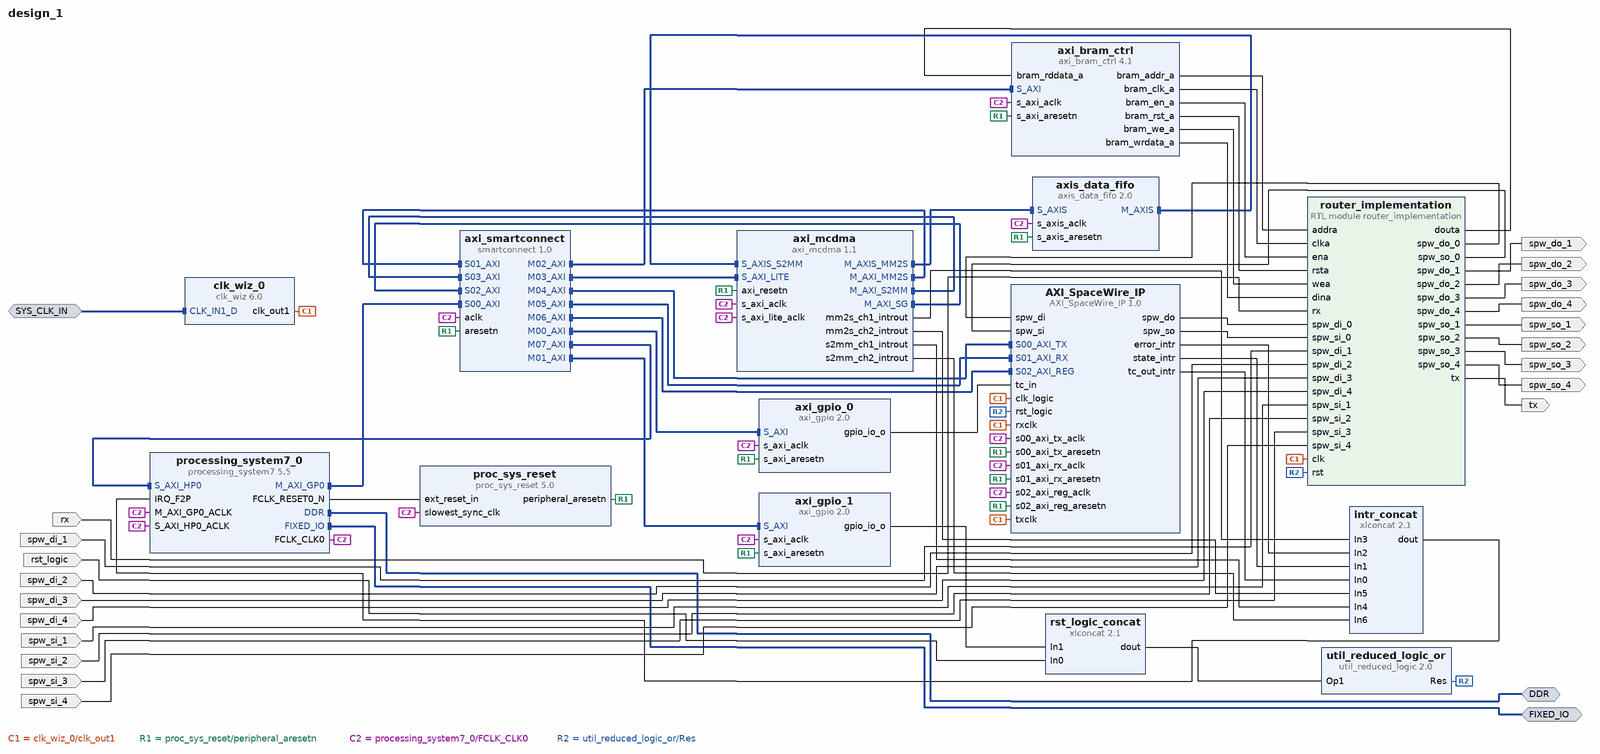
[diagram p0: block diagram of the top level]
# Vivado block design design_1, xc7z045ffg900-2, Vivado 2022.1
create_bd_design design_1

create_bd_intf_port -mode Master -vlnv xilinx.com:interface:ddrx_rtl:1.0 DDR
create_bd_intf_port -mode Master -vlnv xilinx.com:display_processing_system7:fixedio_rtl:1.0 FIXED_IO
create_bd_intf_port -mode Slave -vlnv xilinx.com:interface:diff_clock_rtl:1.0 SYS_CLK_IN
create_bd_port -dir O tx
create_bd_port -dir I rx
create_bd_port -dir I -type rst rst_logic
set_property -dict {CONFIG.POLARITY ACTIVE_HIGH} [get_bd_ports rst_logic]
create_bd_port -dir I spw_di_1
create_bd_port -dir I spw_si_1
create_bd_port -dir I spw_di_2
create_bd_port -dir I spw_si_2
create_bd_port -dir I spw_di_3
create_bd_port -dir I spw_si_3
create_bd_port -dir I spw_di_4
create_bd_port -dir I spw_si_4
create_bd_port -dir O spw_do_1
create_bd_port -dir O spw_so_1
create_bd_port -dir O spw_do_2
create_bd_port -dir O spw_so_2
create_bd_port -dir O spw_do_3
create_bd_port -dir O spw_so_3
create_bd_port -dir O spw_do_4
create_bd_port -dir O spw_so_4

create_bd_cell -type ip -vlnv xilinx.com:ip:processing_system7:5.5 processing_system7_0
set_property -dict [list \
  CONFIG.PCW_APU_PERIPHERAL_FREQMHZ 667.000000 \
  CONFIG.PCW_DUAL_PARALLEL_QSPI_DATA_MODE x8 \
  CONFIG.PCW_ENET0_ENET0_IO {MIO 16 .. 27} \
  CONFIG.PCW_ENET0_GRP_MDIO_ENABLE 1 \
  CONFIG.PCW_ENET0_GRP_MDIO_IO {MIO 52 .. 53} \
  CONFIG.PCW_ENET0_PERIPHERAL_ENABLE 1 \
  CONFIG.PCW_ENET0_PERIPHERAL_FREQMHZ {100 Mbps} \
  CONFIG.PCW_ENET0_RESET_ENABLE 1 \
  CONFIG.PCW_ENET0_RESET_IO {MIO 47} \
  CONFIG.PCW_ENET_RESET_ENABLE 1 \
  CONFIG.PCW_ENET_RESET_SELECT {Share reset pin} \
  CONFIG.PCW_GPIO_MIO_GPIO_ENABLE 1 \
  CONFIG.PCW_GPIO_MIO_GPIO_IO MIO \
  CONFIG.PCW_I2C0_GRP_INT_ENABLE 0 \
  CONFIG.PCW_I2C0_I2C0_IO {MIO 50 .. 51} \
  CONFIG.PCW_I2C0_PERIPHERAL_ENABLE 1 \
  CONFIG.PCW_I2C0_RESET_ENABLE 1 \
  CONFIG.PCW_I2C0_RESET_IO {MIO 46} \
  CONFIG.PCW_I2C_PERIPHERAL_FREQMHZ 111.111115 \
  CONFIG.PCW_I2C_RESET_ENABLE 1 \
  CONFIG.PCW_I2C_RESET_SELECT {Share reset pin} \
  CONFIG.PCW_IRQ_F2P_INTR 1 \
  CONFIG.PCW_PRESET_BANK0_VOLTAGE {LVCMOS 1.8V} \
  CONFIG.PCW_PRESET_BANK1_VOLTAGE {LVCMOS 1.8V} \
  CONFIG.PCW_QSPI_GRP_FBCLK_ENABLE 1 \
  CONFIG.PCW_QSPI_GRP_FBCLK_IO {MIO 8} \
  CONFIG.PCW_QSPI_GRP_IO1_ENABLE 1 \
  CONFIG.PCW_QSPI_GRP_IO1_IO {MIO 0 9 .. 13} \
  CONFIG.PCW_QSPI_GRP_SINGLE_SS_ENABLE 0 \
  CONFIG.PCW_QSPI_INTERNAL_HIGHADDRESS 0xFDFFFFFF \
  CONFIG.PCW_QSPI_PERIPHERAL_ENABLE 1 \
  CONFIG.PCW_QSPI_QSPI_IO {MIO 1 .. 6} \
  CONFIG.PCW_SD0_GRP_CD_ENABLE 1 \
  CONFIG.PCW_SD0_GRP_CD_IO {MIO 14} \
  CONFIG.PCW_SD0_GRP_WP_ENABLE 1 \
  CONFIG.PCW_SD0_GRP_WP_IO {MIO 15} \
  CONFIG.PCW_SD0_PERIPHERAL_ENABLE 1 \
  CONFIG.PCW_SD0_SD0_IO {MIO 40 .. 45} \
  CONFIG.PCW_SDIO_PERIPHERAL_FREQMHZ 50 \
  CONFIG.PCW_TTC0_PERIPHERAL_ENABLE 1 \
  CONFIG.PCW_TTC0_TTC0_IO EMIO \
  CONFIG.PCW_UART1_PERIPHERAL_ENABLE 1 \
  CONFIG.PCW_UART1_UART1_IO {MIO 48 .. 49} \
  CONFIG.PCW_UART_PERIPHERAL_FREQMHZ 50 \
  CONFIG.PCW_UIPARAM_DDR_FREQ_MHZ 533.333313 \
  CONFIG.PCW_UIPARAM_DDR_PARTNO Custom \
  CONFIG.PCW_USB0_PERIPHERAL_ENABLE 1 \
  CONFIG.PCW_USB0_RESET_ENABLE 1 \
  CONFIG.PCW_USB0_RESET_IO {MIO 7} \
  CONFIG.PCW_USB0_USB0_IO {MIO 28 .. 39} \
  CONFIG.PCW_USB_RESET_ENABLE 1 \
  CONFIG.PCW_USB_RESET_SELECT {Share reset pin} \
  CONFIG.PCW_USE_FABRIC_INTERRUPT 1 \
  CONFIG.PCW_USE_S_AXI_HP0 1 \
  CONFIG.preset ZC706 \
] [get_bd_cells processing_system7_0]
# 235 more settings of processing_system7_0 are not shown: defaults, MIO pin electricals, DDR timing, and values the tool derives
create_bd_cell -type ip -vlnv xilinx.com:ip:xlconcat:2.1 intr_concat
set_property -dict {CONFIG.NUM_PORTS 7} [get_bd_cells intr_concat]
create_bd_cell -type ip -vlnv xilinx.com:ip:xlconcat:2.1 rst_logic_concat
create_bd_cell -type ip -vlnv xilinx.com:ip:util_reduced_logic:2.0 util_reduced_logic_or
set_property -dict {CONFIG.C_OPERATION or CONFIG.C_SIZE 2} [get_bd_cells util_reduced_logic_or]
create_bd_cell -type ip -vlnv xilinx.com:ip:proc_sys_reset:5.0 proc_sys_reset
create_bd_cell -type ip -vlnv uni-wuerzburg.informatikviii:user:AXI_SpaceWire_IP:1.0 AXI_SpaceWire_IP
create_bd_cell -type ip -vlnv xilinx.com:ip:axi_bram_ctrl:4.1 axi_bram_ctrl
set_property -dict {CONFIG.SINGLE_PORT_BRAM 1} [get_bd_cells axi_bram_ctrl]
create_bd_cell -type ip -vlnv xilinx.com:ip:axi_gpio:2.0 axi_gpio_0
set_property -dict {CONFIG.C_ALL_OUTPUTS 1 CONFIG.C_GPIO_WIDTH 1} [get_bd_cells axi_gpio_0]
create_bd_cell -type ip -vlnv xilinx.com:ip:axi_gpio:2.0 axi_gpio_1
set_property -dict {CONFIG.C_ALL_OUTPUTS 1 CONFIG.C_GPIO_WIDTH 2} [get_bd_cells axi_gpio_1]
create_bd_cell -type ip -vlnv xilinx.com:ip:axi_mcdma:1.1 axi_mcdma
set_property -dict [list \
  CONFIG.c_group1_mm2s 0000000000000011 \
  CONFIG.c_group1_s2mm 0000000000000011 \
  CONFIG.c_mm2s_burst_size 256 \
  CONFIG.c_mm2s_scheduler 3 \
  CONFIG.c_num_mm2s_channels 2 \
  CONFIG.c_num_s2mm_channels 2 \
  CONFIG.c_s2mm_burst_size 256 \
] [get_bd_cells axi_mcdma]
create_bd_cell -type ip -vlnv xilinx.com:ip:axis_data_fifo:2.0 axis_data_fifo
create_bd_cell -type ip -vlnv xilinx.com:ip:smartconnect:1.0 axi_smartconnect
set_property -dict {CONFIG.NUM_MI 8 CONFIG.NUM_SI 4} [get_bd_cells axi_smartconnect]
create_bd_cell -type ip -vlnv xilinx.com:ip:clk_wiz:6.0 clk_wiz_0
set_property -dict [list \
  CONFIG.CLKIN1_JITTER_PS 50.0 \
  CONFIG.CLKOUT1_JITTER 112.316 \
  CONFIG.CLKOUT1_PHASE_ERROR 89.971 \
  CONFIG.CLKOUT2_JITTER 98.146 \
  CONFIG.CLKOUT2_PHASE_ERROR 89.971 \
  CONFIG.CLKOUT2_REQUESTED_OUT_FREQ 200.000 \
  CONFIG.CLKOUT2_USED true \
  CONFIG.CLK_IN1_BOARD_INTERFACE sys_diff_clock \
  CONFIG.MMCM_CLKFBOUT_MULT_F 5.000 \
  CONFIG.MMCM_CLKIN1_PERIOD 5.000 \
  CONFIG.MMCM_CLKIN2_PERIOD 10.0 \
  CONFIG.MMCM_CLKOUT1_DIVIDE 5 \
  CONFIG.NUM_OUT_CLKS 2 \
  CONFIG.PRIM_SOURCE Differential_clock_capable_pin \
  CONFIG.RESET_BOARD_INTERFACE reset \
] [get_bd_cells clk_wiz_0]
create_bd_cell -type module -reference router_implementation router_implementation

# ---- connections ----

connect_bd_intf_net [get_bd_intf_ports SYS_CLK_IN] [get_bd_intf_pins clk_wiz_0/CLK_IN1_D]
connect_bd_intf_net -intf_net axi_mcdma_0_M_AXIS_MM2S [get_bd_intf_pins axis_data_fifo/S_AXIS] [get_bd_intf_pins axi_mcdma/M_AXIS_MM2S]
connect_bd_intf_net -intf_net axi_mcdma_0_M_AXI_MM2S [get_bd_intf_pins axi_mcdma/M_AXI_MM2S] [get_bd_intf_pins axi_smartconnect/S01_AXI]
connect_bd_intf_net -intf_net axi_mcdma_0_M_AXI_S2MM [get_bd_intf_pins axi_mcdma/M_AXI_S2MM] [get_bd_intf_pins axi_smartconnect/S03_AXI]
connect_bd_intf_net -intf_net axi_mcdma_0_M_AXI_SG [get_bd_intf_pins axi_mcdma/M_AXI_SG] [get_bd_intf_pins axi_smartconnect/S02_AXI]
connect_bd_intf_net -intf_net axis_data_fifo_0_M_AXIS [get_bd_intf_pins axi_mcdma/S_AXIS_S2MM] [get_bd_intf_pins axis_data_fifo/M_AXIS]
connect_bd_intf_net [get_bd_intf_ports DDR] [get_bd_intf_pins processing_system7_0/DDR]
connect_bd_intf_net [get_bd_intf_ports FIXED_IO] [get_bd_intf_pins processing_system7_0/FIXED_IO]
connect_bd_intf_net [get_bd_intf_pins axi_smartconnect/S00_AXI] [get_bd_intf_pins processing_system7_0/M_AXI_GP0]
connect_bd_intf_net -intf_net smartconnect_0_M00_AXI [get_bd_intf_pins axi_smartconnect/M00_AXI] [get_bd_intf_pins axi_gpio_0/S_AXI]
connect_bd_intf_net -intf_net smartconnect_0_M01_AXI [get_bd_intf_pins axi_gpio_1/S_AXI] [get_bd_intf_pins axi_smartconnect/M01_AXI]
connect_bd_intf_net -intf_net smartconnect_0_M02_AXI [get_bd_intf_pins axi_smartconnect/M02_AXI] [get_bd_intf_pins axi_bram_ctrl/S_AXI]
connect_bd_intf_net -intf_net smartconnect_0_M03_AXI [get_bd_intf_pins axi_smartconnect/M03_AXI] [get_bd_intf_pins axi_mcdma/S_AXI_LITE]
connect_bd_intf_net -intf_net smartconnect_0_M04_AXI [get_bd_intf_pins axi_smartconnect/M04_AXI] [get_bd_intf_pins AXI_SpaceWire_IP/S00_AXI_TX]
connect_bd_intf_net -intf_net smartconnect_0_M05_AXI [get_bd_intf_pins axi_smartconnect/M05_AXI] [get_bd_intf_pins AXI_SpaceWire_IP/S01_AXI_RX]
connect_bd_intf_net -intf_net smartconnect_0_M06_AXI [get_bd_intf_pins axi_smartconnect/M06_AXI] [get_bd_intf_pins AXI_SpaceWire_IP/S02_AXI_REG]
connect_bd_intf_net -intf_net smartconnect_0_M07_AXI [get_bd_intf_pins axi_smartconnect/M07_AXI] [get_bd_intf_pins processing_system7_0/S_AXI_HP0]
connect_bd_net -net AXI_SpaceWire_IP_0_error_intr [get_bd_pins AXI_SpaceWire_IP/error_intr] [get_bd_pins intr_concat/In2]
connect_bd_net -net AXI_SpaceWire_IP_0_spw_do [get_bd_pins AXI_SpaceWire_IP/spw_do] [get_bd_pins router_implementation/spw_di_0]
connect_bd_net -net AXI_SpaceWire_IP_0_spw_so [get_bd_pins AXI_SpaceWire_IP/spw_so] [get_bd_pins router_implementation/spw_si_0]
connect_bd_net -net AXI_SpaceWire_IP_0_state_intr [get_bd_pins AXI_SpaceWire_IP/state_intr] [get_bd_pins intr_concat/In1]
connect_bd_net -net AXI_SpaceWire_IP_0_tc_out_intr [get_bd_pins AXI_SpaceWire_IP/tc_out_intr] [get_bd_pins intr_concat/In0]
connect_bd_net -net axi_bram_ctrl_0_bram_addr_a [get_bd_pins axi_bram_ctrl/bram_addr_a] [get_bd_pins router_implementation/addra]
connect_bd_net -net axi_bram_ctrl_0_bram_clk_a [get_bd_pins axi_bram_ctrl/bram_clk_a] [get_bd_pins router_implementation/clka]
connect_bd_net -net axi_bram_ctrl_0_bram_en_a [get_bd_pins axi_bram_ctrl/bram_en_a] [get_bd_pins router_implementation/ena]
connect_bd_net -net axi_bram_ctrl_0_bram_rst_a [get_bd_pins axi_bram_ctrl/bram_rst_a] [get_bd_pins router_implementation/rsta]
connect_bd_net -net axi_bram_ctrl_0_bram_we_a [get_bd_pins axi_bram_ctrl/bram_we_a] [get_bd_pins router_implementation/wea]
connect_bd_net -net axi_bram_ctrl_0_bram_wrdata_a [get_bd_pins axi_bram_ctrl/bram_wrdata_a] [get_bd_pins router_implementation/dina]
connect_bd_net [get_bd_pins axi_gpio_0/gpio_io_o] [get_bd_pins AXI_SpaceWire_IP/tc_in]
connect_bd_net [get_bd_pins axi_gpio_1/gpio_io_o] [get_bd_pins rst_logic_concat/In1]
connect_bd_net -net axi_mcdma_0_mm2s_ch1_introut [get_bd_pins axi_mcdma/mm2s_ch1_introut] [get_bd_pins intr_concat/In3]
connect_bd_net -net axi_mcdma_0_mm2s_ch2_introut [get_bd_pins axi_mcdma/mm2s_ch2_introut] [get_bd_pins intr_concat/In5]
connect_bd_net -net axi_mcdma_0_s2mm_ch1_introut [get_bd_pins axi_mcdma/s2mm_ch1_introut] [get_bd_pins intr_concat/In4]
connect_bd_net -net axi_mcdma_0_s2mm_ch2_introut [get_bd_pins axi_mcdma/s2mm_ch2_introut] [get_bd_pins intr_concat/In6]
connect_bd_net [get_bd_pins clk_wiz_0/clk_out1] \
  [get_bd_pins AXI_SpaceWire_IP/clk_logic] [get_bd_pins AXI_SpaceWire_IP/rxclk] [get_bd_pins AXI_SpaceWire_IP/txclk] \
  [get_bd_pins router_implementation/clk]
connect_bd_net -net proc_sys_reset_0_peripheral_aresetn [get_bd_pins proc_sys_reset/peripheral_aresetn] \
  [get_bd_pins AXI_SpaceWire_IP/s00_axi_tx_aresetn] [get_bd_pins AXI_SpaceWire_IP/s01_axi_rx_aresetn] \
  [get_bd_pins AXI_SpaceWire_IP/s02_axi_reg_aresetn] [get_bd_pins axi_bram_ctrl/s_axi_aresetn] \
  [get_bd_pins axi_gpio_0/s_axi_aresetn] [get_bd_pins axi_gpio_1/s_axi_aresetn] [get_bd_pins axi_mcdma/axi_resetn] \
  [get_bd_pins axis_data_fifo/s_axis_aresetn] [get_bd_pins axi_smartconnect/aresetn]
connect_bd_net [get_bd_pins processing_system7_0/FCLK_CLK0] \
  [get_bd_pins processing_system7_0/M_AXI_GP0_ACLK] [get_bd_pins proc_sys_reset/slowest_sync_clk] \
  [get_bd_pins processing_system7_0/S_AXI_HP0_ACLK] [get_bd_pins AXI_SpaceWire_IP/s00_axi_tx_aclk] \
  [get_bd_pins AXI_SpaceWire_IP/s01_axi_rx_aclk] [get_bd_pins AXI_SpaceWire_IP/s02_axi_reg_aclk] \
  [get_bd_pins axi_bram_ctrl/s_axi_aclk] [get_bd_pins axi_gpio_0/s_axi_aclk] [get_bd_pins axi_gpio_1/s_axi_aclk] \
  [get_bd_pins axi_mcdma/s_axi_aclk] [get_bd_pins axi_mcdma/s_axi_lite_aclk] [get_bd_pins axis_data_fifo/s_axis_aclk] \
  [get_bd_pins axi_smartconnect/aclk]
connect_bd_net [get_bd_pins processing_system7_0/FCLK_RESET0_N] [get_bd_pins proc_sys_reset/ext_reset_in]
connect_bd_net -net reset_rtl_1 [get_bd_ports rst_logic] [get_bd_pins rst_logic_concat/In0]
connect_bd_net -net router_implementation_0_douta [get_bd_pins router_implementation/douta] [get_bd_pins axi_bram_ctrl/bram_rddata_a]
connect_bd_net -net router_implementation_0_spw_do [get_bd_pins router_implementation/spw_do_0] [get_bd_pins AXI_SpaceWire_IP/spw_di]
connect_bd_net -net router_implementation_0_spw_do_1 [get_bd_pins router_implementation/spw_do_1] [get_bd_ports spw_do_1]
connect_bd_net -net router_implementation_0_spw_do_2 [get_bd_pins router_implementation/spw_do_2] [get_bd_ports spw_do_2]
connect_bd_net -net router_implementation_0_spw_do_3 [get_bd_pins router_implementation/spw_do_3] [get_bd_ports spw_do_3]
connect_bd_net -net router_implementation_0_spw_do_4 [get_bd_pins router_implementation/spw_do_4] [get_bd_ports spw_do_4]
connect_bd_net -net router_implementation_0_spw_so [get_bd_pins router_implementation/spw_so_0] [get_bd_pins AXI_SpaceWire_IP/spw_si]
connect_bd_net -net router_implementation_0_spw_so_1 [get_bd_pins router_implementation/spw_so_1] [get_bd_ports spw_so_1]
connect_bd_net -net router_implementation_0_spw_so_2 [get_bd_pins router_implementation/spw_so_2] [get_bd_ports spw_so_2]
connect_bd_net -net router_implementation_0_spw_so_3 [get_bd_pins router_implementation/spw_so_3] [get_bd_ports spw_so_3]
connect_bd_net -net router_implementation_0_spw_so_4 [get_bd_pins router_implementation/spw_so_4] [get_bd_ports spw_so_4]
connect_bd_net -net router_implementation_0_tx [get_bd_pins router_implementation/tx] [get_bd_ports tx]
connect_bd_net -net rx_0_1 [get_bd_ports rx] [get_bd_pins router_implementation/rx]
connect_bd_net -net spw_di_1_0_1 [get_bd_ports spw_di_1] [get_bd_pins router_implementation/spw_di_1]
connect_bd_net -net spw_di_2_0_1 [get_bd_ports spw_di_2] [get_bd_pins router_implementation/spw_di_2]
connect_bd_net -net spw_di_3_0_1 [get_bd_ports spw_di_3] [get_bd_pins router_implementation/spw_di_3]
connect_bd_net -net spw_di_4_0_1 [get_bd_ports spw_di_4] [get_bd_pins router_implementation/spw_di_4]
connect_bd_net -net spw_si_1_0_1 [get_bd_ports spw_si_1] [get_bd_pins router_implementation/spw_si_1]
connect_bd_net -net spw_si_2_0_1 [get_bd_ports spw_si_2] [get_bd_pins router_implementation/spw_si_2]
connect_bd_net -net spw_si_3_0_1 [get_bd_ports spw_si_3] [get_bd_pins router_implementation/spw_si_3]
connect_bd_net -net spw_si_4_0_1 [get_bd_ports spw_si_4] [get_bd_pins router_implementation/spw_si_4]
connect_bd_net -net util_reduced_logic_0_Res [get_bd_pins util_reduced_logic_or/Res] \
  [get_bd_pins AXI_SpaceWire_IP/rst_logic] [get_bd_pins router_implementation/rst]
connect_bd_net -net xlconcat_0_dout [get_bd_pins intr_concat/dout] [get_bd_pins processing_system7_0/IRQ_F2P]
connect_bd_net -net xlconcat_1_dout [get_bd_pins rst_logic_concat/dout] [get_bd_pins util_reduced_logic_or/Op1]

# ---- address map ----
assign_bd_address -offset 0x00000000 -range 1G -target_address_space [get_bd_addr_spaces axi_mcdma/Data_MM2S] [get_bd_addr_segs processing_system7_0/S_AXI_HP0/HP0_DDR_LOWOCM]
assign_bd_address -offset 0x40000000 -range 16K -target_address_space [get_bd_addr_spaces axi_mcdma/Data_MM2S] [get_bd_addr_segs axi_bram_ctrl/S_AXI/Mem0]
assign_bd_address -offset 0x41200000 -range 128 -target_address_space [get_bd_addr_spaces axi_mcdma/Data_MM2S] [get_bd_addr_segs axi_gpio_0/S_AXI/Reg]
assign_bd_address -offset 0x41210000 -range 128 -target_address_space [get_bd_addr_spaces axi_mcdma/Data_MM2S] [get_bd_addr_segs axi_gpio_1/S_AXI/Reg]
assign_bd_address -offset 0x43C00000 -range 4K -target_address_space [get_bd_addr_spaces axi_mcdma/Data_MM2S] [get_bd_addr_segs AXI_SpaceWire_IP/S02_AXI_REG/S02_AXI_REG_reg]
assign_bd_address -offset 0x43C10000 -range 64K -target_address_space [get_bd_addr_spaces axi_mcdma/Data_MM2S] [get_bd_addr_segs axi_mcdma/S_AXI_LITE/Reg]
assign_bd_address -offset 0x7AA00000 -range 4K -target_address_space [get_bd_addr_spaces axi_mcdma/Data_MM2S] [get_bd_addr_segs AXI_SpaceWire_IP/S00_AXI_TX/S00_AXI_TX_mem]
assign_bd_address -offset 0x7AA10000 -range 4K -target_address_space [get_bd_addr_spaces axi_mcdma/Data_MM2S] [get_bd_addr_segs AXI_SpaceWire_IP/S01_AXI_RX/S01_AXI_RX_mem]
assign_bd_address -offset 0x00000000 -range 1G -target_address_space [get_bd_addr_spaces axi_mcdma/Data_S2MM] [get_bd_addr_segs processing_system7_0/S_AXI_HP0/HP0_DDR_LOWOCM]
assign_bd_address -offset 0x40000000 -range 16K -target_address_space [get_bd_addr_spaces axi_mcdma/Data_S2MM] [get_bd_addr_segs axi_bram_ctrl/S_AXI/Mem0]
assign_bd_address -offset 0x41200000 -range 128 -target_address_space [get_bd_addr_spaces axi_mcdma/Data_S2MM] [get_bd_addr_segs axi_gpio_0/S_AXI/Reg]
assign_bd_address -offset 0x41210000 -range 128 -target_address_space [get_bd_addr_spaces axi_mcdma/Data_S2MM] [get_bd_addr_segs axi_gpio_1/S_AXI/Reg]
assign_bd_address -offset 0x43C00000 -range 4K -target_address_space [get_bd_addr_spaces axi_mcdma/Data_S2MM] [get_bd_addr_segs AXI_SpaceWire_IP/S02_AXI_REG/S02_AXI_REG_reg]
assign_bd_address -offset 0x43C10000 -range 64K -target_address_space [get_bd_addr_spaces axi_mcdma/Data_S2MM] [get_bd_addr_segs axi_mcdma/S_AXI_LITE/Reg]
assign_bd_address -offset 0x7AA00000 -range 4K -target_address_space [get_bd_addr_spaces axi_mcdma/Data_S2MM] [get_bd_addr_segs AXI_SpaceWire_IP/S00_AXI_TX/S00_AXI_TX_mem]
assign_bd_address -offset 0x7AA10000 -range 4K -target_address_space [get_bd_addr_spaces axi_mcdma/Data_S2MM] [get_bd_addr_segs AXI_SpaceWire_IP/S01_AXI_RX/S01_AXI_RX_mem]
assign_bd_address -offset 0x00000000 -range 1G -target_address_space [get_bd_addr_spaces axi_mcdma/Data_SG] [get_bd_addr_segs processing_system7_0/S_AXI_HP0/HP0_DDR_LOWOCM]
assign_bd_address -offset 0x40000000 -range 16K -target_address_space [get_bd_addr_spaces axi_mcdma/Data_SG] [get_bd_addr_segs axi_bram_ctrl/S_AXI/Mem0]
assign_bd_address -offset 0x41200000 -range 128 -target_address_space [get_bd_addr_spaces axi_mcdma/Data_SG] [get_bd_addr_segs axi_gpio_0/S_AXI/Reg]
assign_bd_address -offset 0x41210000 -range 128 -target_address_space [get_bd_addr_spaces axi_mcdma/Data_SG] [get_bd_addr_segs axi_gpio_1/S_AXI/Reg]
assign_bd_address -offset 0x43C00000 -range 4K -target_address_space [get_bd_addr_spaces axi_mcdma/Data_SG] [get_bd_addr_segs AXI_SpaceWire_IP/S02_AXI_REG/S02_AXI_REG_reg]
assign_bd_address -offset 0x43C10000 -range 64K -target_address_space [get_bd_addr_spaces axi_mcdma/Data_SG] [get_bd_addr_segs axi_mcdma/S_AXI_LITE/Reg]
assign_bd_address -offset 0x7AA00000 -range 4K -target_address_space [get_bd_addr_spaces axi_mcdma/Data_SG] [get_bd_addr_segs AXI_SpaceWire_IP/S00_AXI_TX/S00_AXI_TX_mem]
assign_bd_address -offset 0x7AA10000 -range 4K -target_address_space [get_bd_addr_spaces axi_mcdma/Data_SG] [get_bd_addr_segs AXI_SpaceWire_IP/S01_AXI_RX/S01_AXI_RX_mem]
assign_bd_address -offset 0x40000000 -range 16K -target_address_space [get_bd_addr_spaces processing_system7_0/Data] [get_bd_addr_segs axi_bram_ctrl/S_AXI/Mem0]
assign_bd_address -offset 0x41200000 -range 128 -target_address_space [get_bd_addr_spaces processing_system7_0/Data] [get_bd_addr_segs axi_gpio_0/S_AXI/Reg]
assign_bd_address -offset 0x41210000 -range 128 -target_address_space [get_bd_addr_spaces processing_system7_0/Data] [get_bd_addr_segs axi_gpio_1/S_AXI/Reg]
assign_bd_address -offset 0x43C00000 -range 4K -target_address_space [get_bd_addr_spaces processing_system7_0/Data] [get_bd_addr_segs AXI_SpaceWire_IP/S02_AXI_REG/S02_AXI_REG_reg]
assign_bd_address -offset 0x43C10000 -range 64K -target_address_space [get_bd_addr_spaces processing_system7_0/Data] [get_bd_addr_segs axi_mcdma/S_AXI_LITE/Reg]
assign_bd_address -offset 0x7AA00000 -range 4K -target_address_space [get_bd_addr_spaces processing_system7_0/Data] [get_bd_addr_segs AXI_SpaceWire_IP/S00_AXI_TX/S00_AXI_TX_mem]
assign_bd_address -offset 0x7AA10000 -range 4K -target_address_space [get_bd_addr_spaces processing_system7_0/Data] [get_bd_addr_segs AXI_SpaceWire_IP/S01_AXI_RX/S01_AXI_RX_mem]
exclude_bd_addr_seg -offset 0x00000000 -range 1 -target_address_space [get_bd_addr_spaces processing_system7_0/Data] [get_bd_addr_segs processing_system7_0/S_AXI_HP0/HP0_DDR_LOWOCM]

validate_bd_design
save_bd_design
